# EAGLE design TSOC_PSoC4L (EAGLE 6.6.0)
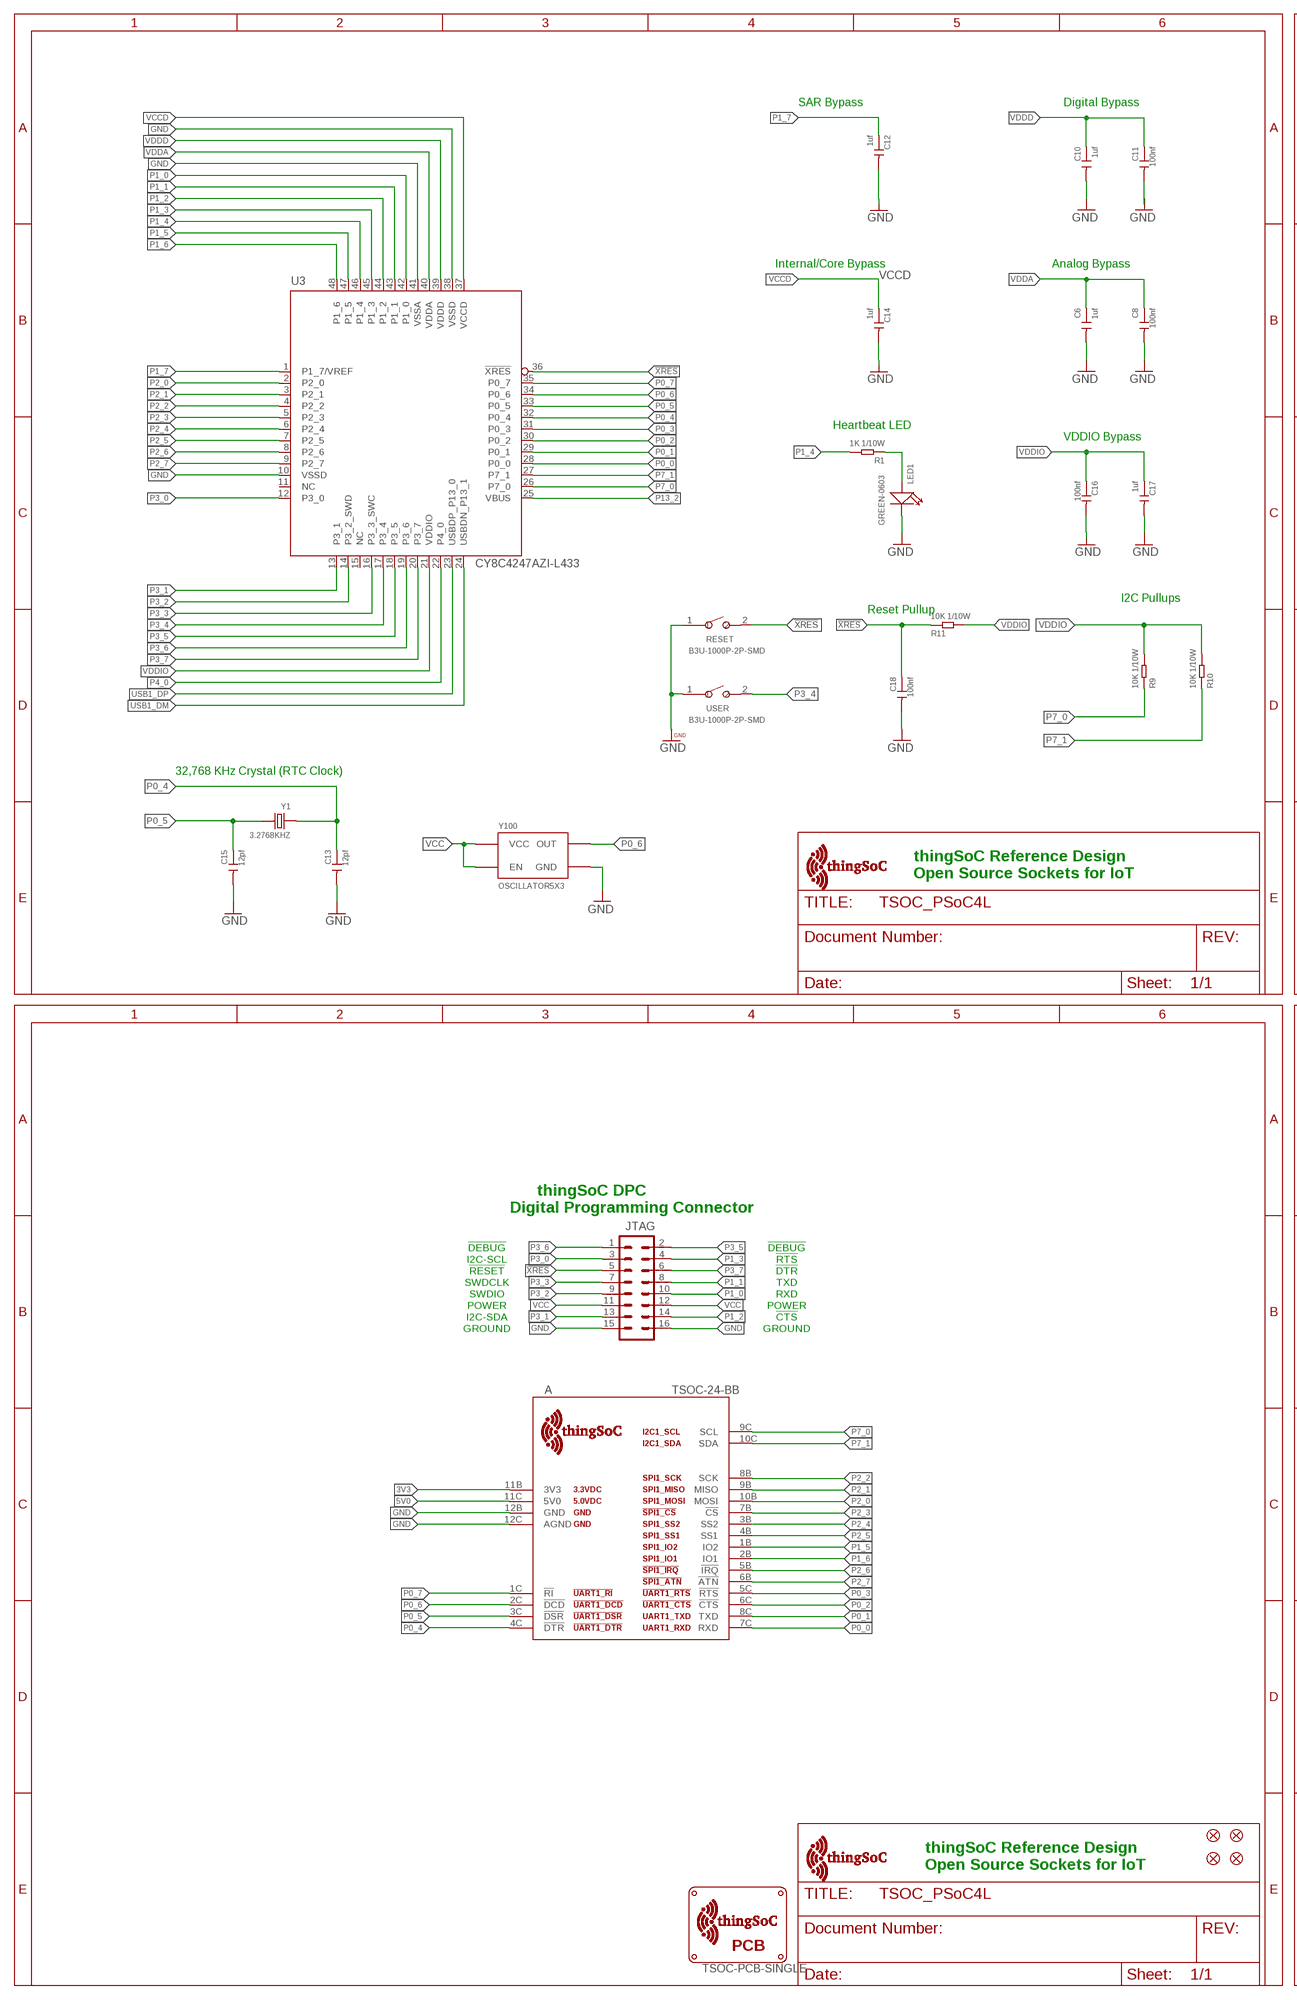
[diagram p0: schematic, sheet 1, part 1 of 2]
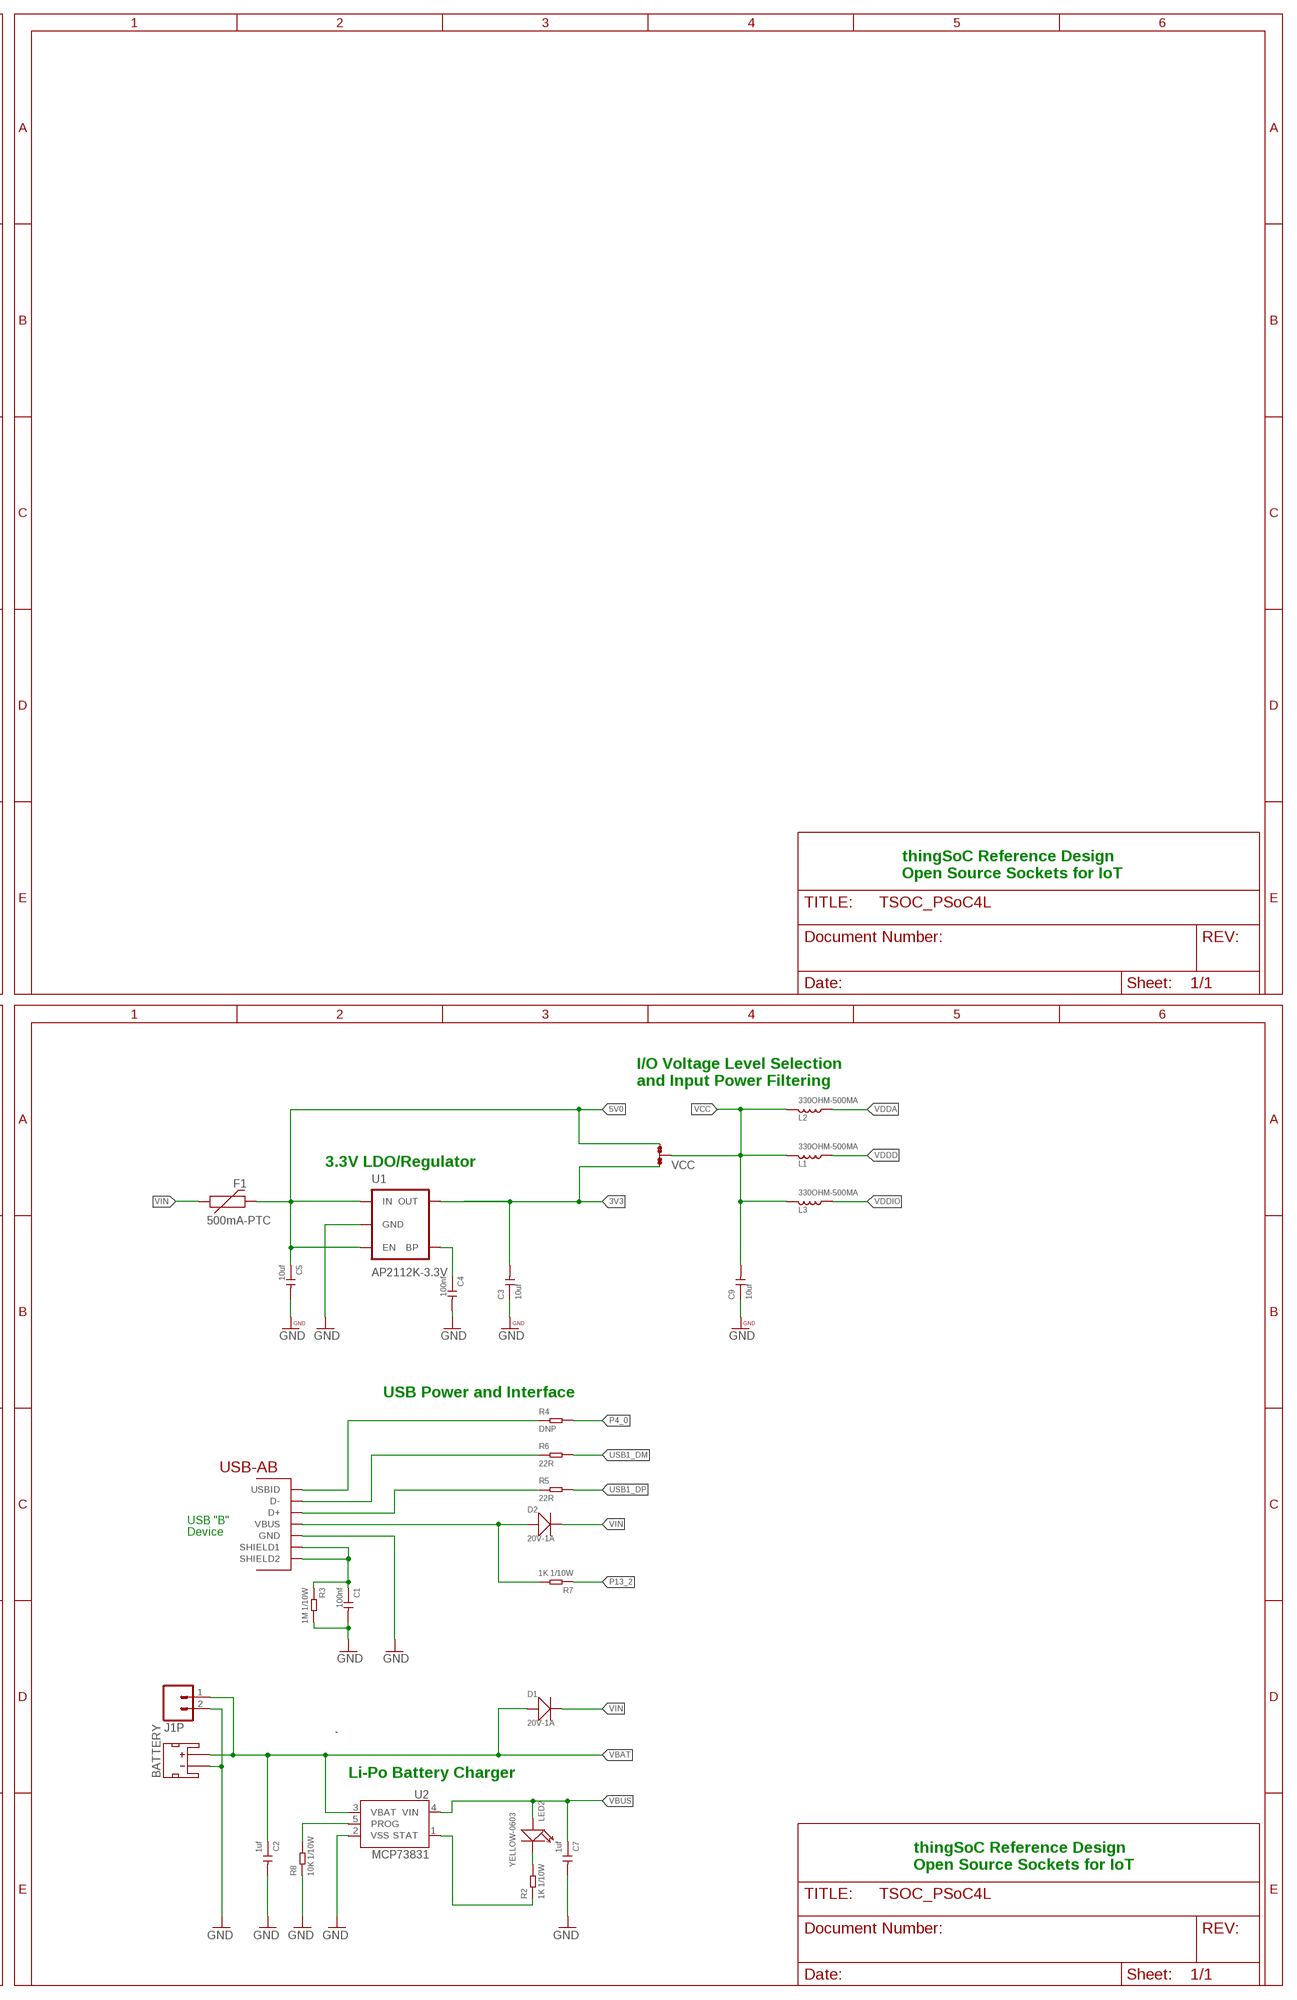
[diagram p1: schematic, sheet 1, part 2 of 2]

## Parts
A  TSOC-24-BB  [TSOC-BB-S24]
BATTERY  JST_2MM_MALE  [JST-2-SMD]
C1  100nf  CERAMIC-100NF-50V-10%-X7R(0603)  [C0603]
C2  1uf  CERAMIC-1UF-25V-10%-X7R(0603)  [C0603]
C3  10uf  CERAMIC-10UF-10V-10%-X5R(0603)  [C0603]
C4  100nf  CERAMIC-100NF-50V-10%-X7R(0603)  [C0603]
C5  10uf  CERAMIC-10UF-10V-10%-X5R(0603)  [C0603]
C6  1uf  CERAMIC-1UF-25V-10%-X7R(0603)  [C0603]
C7  1uf  CERAMIC-1UF-25V-10%-X7R(0603)  [C0603]
C8  100nf  CERAMIC-100NF-50V-10%-X7R(0603)  [C0603]
C9  10uf  CERAMIC-10UF-10V-10%-X5R(0603)  [C0603]
C10  1uf  CERAMIC-1UF-25V-10%-X7R(0603)  [C0603]
C11  100nf  CERAMIC-100NF-50V-10%-X7R(0603)  [C0603]
C12  1uf  CERAMIC-1UF-25V-10%-X7R(0603)  [C0603]
C13  12pf  CERAMIC-12PF-50V-5%-NPO(0603)  [C0603]
C14  1uf  CERAMIC-1UF-25V-10%-X7R(0603)  [C0603]
C15  12pf  CERAMIC-12PF-50V-5%-NPO(0603)  [C0603]
C16  100nf  CERAMIC-100NF-50V-10%-X7R(0603)  [C0603]
C17  1uf  CERAMIC-1UF-25V-10%-X7R(0603)  [C0603]
C18  100nf  CERAMIC-100NF-50V-10%-X7R(0603)  [C0603]
D1  20V-1A  SMD-DIODE-SCHOTTKY-20V-1A(SOD-123)  [SOD-123]
D2  20V-1A  SMD-DIODE-SCHOTTKY-20V-1A(SOD-123)  [SOD-123]
F1  500mA-PTC  PTCSMD  [PTC-1206]
FID1  FIDUCIALUFIDUCIAL  [MICRO-FIDUCIAL]
FID2  FIDUCIALUFIDUCIAL  [MICRO-FIDUCIAL]
FID3  FIDUCIALUFIDUCIAL  [MICRO-FIDUCIAL]
FID4  FIDUCIALUFIDUCIAL  [MICRO-FIDUCIAL]
J1P  M02-JST-2-PTH-NO_SILK  [JST-2-PTH-NS]
JTAG  M08X2  [2X8]
L1  330OHM-500MA  SMD-FERRITE-CHIP-120-OHM-500MA(0603)  [L0603]
L2  330OHM-500MA  SMD-FERRITE-CHIP-120-OHM-500MA(0603)  [L0603]
L3  330OHM-500MA  SMD-FERRITE-CHIP-120-OHM-500MA(0603)  [L0603]
LED1  GREEN-0603  SMD-LED-CLEAR-GREEN(0603)  [LED-0603]
LED2  YELLOW-0603  SMD-LED-CLEAR-YELLOW(0603)  [LED-0603]
R1  1K 1/10W  SMD-RES-1K-5%-1/10W(0603)  [R0603]
R2  1K 1/10W  SMD-RES-1K-5%-1/10W(0603)  [R0603]
R3  1M 1/10W  SMD-RES-1M-5%-1/10W(0603)  [R0603]
R4  DNP  SMD-RES-22R-5%-1/10W(0603)  [R0603]
R5  22R  SMD-RES-22R-5%-1/10W(0603)  [R0603]
R6  22R  SMD-RES-22R-5%-1/10W(0603)  [R0603]
R7  1K 1/10W  SMD-RES-1K-5%-1/10W(0603)  [R0603]
R8  10K 1/10W  SMD-RES-10K-5%-1/10W(0603)  [R0603]
R9  10K 1/10W  SMD-RES-10K-5%-1/10W(0603)  [R0603]
R10  10K 1/10W  SMD-RES-10K-5%-1/10W(0603)  [R0603]
R11  10K 1/10W  SMD-RES-10K-5%-1/10W(0603)  [R0603]
RESET  B3U-1000P-2P-SMD  SMD-BUTTON(2P-3.0X2.5X1.2+0.4MM)-B3U-1000P-2P-SMD  [SW2-2.6-3.0X2.5X1.2+0.4MM]
U1  AP2112K-3.3V  V_REG_LDOSMD  [SOT23-5]
U2  MCP73831  [SOT23-5]
U3  CY8C4247AZI-L433  [TQFP-7X7-48]
U$1  TSOC-PCB-SINGLE  [TSOC-BB-BRD-DIM]
U$100  TSOC-LOGO-LRG  [TSOC-LOGO-LRG]
U$101  TSOC-LOGO-SMALL  [TSOC-LOGO-SML]
USB  USB_AB  [USB-AB-MICRO-SMD]
USER  B3U-1000P-2P-SMD  SMD-BUTTON(2P-3.0X2.5X1.2+0.4MM)-B3U-1000P-2P-SMD  [SW2-2.6-3.0X2.5X1.2+0.4MM]
VCC  JMP-3-1_2  [JMP-3-1_2]
Y1  3.2768KHZ  SMD-CRYSTAL-32.768KHZ-12.5PF-20PPM-90K(2P-L2.0X1.2MM)  [X2-SMD-L2.0X1.2X0.55MM]
Y100  OSCILLATOR5X3  [CRYSTAL-SMD-5X3]

## Nets
3V3: A.11B(3V3) C3.2 U1.5(OUT) VCC.1
5V0: A.11C(5V0) C5.1 F1.2 U1.1(IN) U1.3(EN) VCC.3
!XRES: C18.1 JTAG.5 R11.1 RESET.2 U3.36(!XRES)
BYPASS1: C4.1 U1.4(BP)
CLED: LED2.- R2.2
CSTAT: R2.1 U2.1(STAT)
GND: A.12B(GND) A.12C(AGND) BATTERY.1(-) C1.2 C2.2 C3.1 C4.2 C5.2 C6.2 C7.2 C8.2 C9.1 C10.2 C11.2 C12.2 C13.2 C14.2 C15.2 C16.2 C17.2 C18.2 J1P.2 JTAG.15 JTAG.16 LED1.- R3.2 R8.1 RESET.1 U1.2(GND) U2.2(VSS) U3.10(VSSD) U3.38(VSSD) U3.41(VSSA) USB.GND USER.1 Y100.2(GND)
N$1: R8.2 U2.5(PROG)
N$17: LED1.+ R1.1
P0_0: A.7C(RXD) U3.28(P0_0)
P0_1: A.8C(TXD) U3.29(P0_1)
P0_2: A.6C(!CTS) U3.30(P0_2)
P0_3: A.5C(!RTS) U3.31(P0_3)
P0_4: A.4C(!DTR) C13.1 U3.32(P0_4) Y1.1
P0_5: A.3C(!DSR) C15.1 U3.33(P0_5) Y1.2
P0_6: A.2C(!DCD) U3.34(P0_6) Y100.3(OUT)
P0_7: A.1C(!RI) U3.35(P0_7)
P1_0: JTAG.10 U3.42(P1_0)
P1_1: JTAG.8 U3.43(P1_1)
P1_2: JTAG.14 U3.44(P1_2)
P1_3: JTAG.4 U3.45(P1_3)
P1_4: R1.2 U3.46(P1_4)
P1_5: A.1B(IO2) U3.47(P1_5)
P1_6: A.2B(IO1) U3.48(P1_6)
P1_7: C12.1 U3.1(P1_7/VREF)
P2_0: A.10B(MOSI) U3.2(P2_0)
P2_1: A.9B(MISO) U3.3(P2_1)
P2_2: A.8B(SCK) U3.4(P2_2)
P2_3: A.7B(!CS) U3.5(P2_3)
P2_4: A.3B(SS2) U3.6(P2_4)
P2_5: A.4B(SS1) U3.7(P2_5)
P2_6: A.5B(!IRQ) U3.8(P2_6)
P2_7: A.6B(!ATN) U3.9(P2_7)
P3_0: JTAG.3 U3.12(P3_0)
P3_1: JTAG.13 U3.13(P3_1)
P3_2: JTAG.9 U3.14(P3_2_SWD)
P3_3: JTAG.7 U3.16(P3_3_SWC)
P3_4: U3.17(P3_4) USER.2
P3_5: JTAG.2 U3.18(P3_5)
P3_6: JTAG.1 U3.19(P3_6)
P3_7: JTAG.6 U3.20(P3_7)
P4_0: R4.2 U3.22(P4_0)
P7_0: A.9C(SCL) R9.1 U3.26(P7_0)
P7_1: A.10C(SDA) R10.1 U3.27(P7_1)
P13_2: R7.1 U3.25(VBUS)
USB1_DM: R6.2 U3.24(USBDN_P13_1)
USB1_DP: R5.2 U3.23(USBDP_P13_0)
USB1_I: R4.1 USB.ID(USBID)
USB1_M: R6.1 USB.D-
USB1_P: R5.1 USB.D+
USB1_SHIELD: C1.1 R3.1 USB.SHIELD1 USB.SHIELD2
VBAT: BATTERY.2(+) C2.1 D1.+ J1P.1 U2.3(VBAT)
VBUS: C7.1 D2.+ LED2.+ R7.2 U2.4(VIN) USB.VBUS
VCC: C9.2 JTAG.11 JTAG.12 L1.1 L2.1 L3.1 VCC.2 Y100.1(EN) Y100.4(VCC)
VCCD: C14.1 U3.37(VCCD)
VDDA: C6.1 C8.1 L2.2 U3.40(VDDA)
VDDD: C10.1 C11.1 L1.2 U3.39(VDDD)
VDDIO: C16.1 C17.1 L3.2 R9.2 R10.2 R11.2 U3.21(VDDIO)
VIN: D1.- D2.- F1.1
Unconnected: BATTERY.NC1(PAD1) BATTERY.NC2(PAD2) U3.11(NC) U3.15(NC)

## Notes on the sheet
- SAR Bypass | Digital Bypass
- Internal/Core Bypass | Analog Bypass
- Heartbeat LED
- VDDIO Bypass
- I2C Pullups
- Reset Pullup
- 32,768 KHz Crystal (RTC Clock)
- thingSoC Reference Design
  Open Source Sockets for IoT
- thingSoC Reference Design
  Open Source Sockets for IoT
- I/O Voltage Level Selection
  and Input Power Filtering
- 3.3V LDO/Regulator
- thingSoC DPC
  Digital Programming Connector
- !DEBUG | !DEBUG
- I2C-SCL | !RTS
- !RESET | !DTR
- SWDCLK | TXD
- SWDIO | RXD
- POWER | POWER
- I2C-SDA | !CTS
- GROUND | GROUND
- USB Power and Interface
- USB "B"
- Device
- Li-Po Battery Charger
- thingSoC Reference Design
  Open Source Sockets for IoT
- thingSoC Reference Design
  Open Source Sockets for IoT

## Library data of the parts
A = thingSoC:TSOC-24: thingSoC Twenty-Four(24) Pin Socket Source LBR : http://www.thingsoc.com Github : https://github.com/thingsoc License : http://creativecommons.org/licenses/by-sa/4.0/ (Creative Commons 4.0) THIS SOFTWARE IS PROVIDED BY THE CONTRIBUTORS "AS IS" AND WITHOUT ANY EXPRESS OR IMPLIED WARRANTIES, INCLUDING, BUT NOT LIMITED TO, THE IMPLIED WARRANTIES OF MERCHANTABILITY AND FITNESS FOR A PARTICULAR PURPOSE ARE DISCLAIMED. IN NO EVENT SHALL THE COPYRIGHT OWNER OR CONTRIBUTORS BE LIABLE FOR ANY DIRECT, INDIRECT, INCIDENTAL, SPECIAL, EXEMPLARY, OR CONSEQUENTIAL DAMAGES (INCLUDING, BUT NOT LIMITED TO, PROCUREMENT OF SUBSTITUTE GOODS OR SERVICES; LOSS OF USE, DATA, OR PROFITS; OR BUSINESS INTERRUPTION) HOWEVER CAUSED AND ON ANY THEORY OF LIABILITY, WHETHER IN CONTRACT, STRICT LIABILITY, OR TORT (INCLUDING NEGLIGENCE OR OTHERWISE) ARISING IN ANY WAY OUT OF THE USE OF THIS SOFTWARE, EVEN IF ADVISED OF THE POSSIBILITY OF SUCH DAMAGE.
BATTERY = TSOC-ESP8266-BASE:JST_2MM_MALE: Mates to single-cell LiPo batteries. CONN-11443 Now with smashable polarity marks!; BTM_NEG: -; BTM_POS: +; PROD_ID: CONN-11443; TOP_NEG: -; TOP_POS: +
C1 C4 C8 C11 C16 C18 = Seeed-Capacitor-2016:CERAMIC-100NF-50V-10%-X7R(0603): 302010138; MPN: CC0603KRX7R9BB104
C2 C6 C7 C10 C12 C14 C17 = Seeed-Capacitor-2016:CERAMIC-1UF-25V-10%-X7R(0603): 302010139; MPN: CC0603KRX7R8BB105
C3 C5 C9 = Seeed-Capacitor-2016:CERAMIC-10UF-10V-10%-X5R(0603): 302010103; MPN: CC0603KRX5R6BB106
C13 C15 = Seeed-Capacitor-2016:CERAMIC-12PF-50V-5%-NPO(0603): 302010067; MPN: CC0603JRNPO9BN120
D1 D2 = Seeed-Diode-2016:SMD-DIODE-SCHOTTKY-20V-1A(SOD-123): 304020034; MPN: B5819W
F1 = SparkFun:PTC: Resettable Fuse PTC Resettable Fuse. Spark Fun Electronics SKU : COM-08357
FID1-FID4 = TSOC-ESP8266-BASE:FIDUCIAL: Fiducial Alignment Points Various fiducial points for machine vision alignment.
J1P = TSOC-ESP8266-BASE:M02: Standard 2-pin 0.1" header. Use with - straight break away headers ( PRT-00116) - right angle break away headers (PRT-00553) - swiss pins (PRT-00743) - machine pins (PRT-00117) - female headers (PRT-00115) Molex polarized connector foot print use with: PRT-08233 with associated crimp pins and housings. 2.54_SCREWTERM for use with PRT-10571. 3.5mm Screw Terminal footprints for PRT-08084 5mm Screw Terminal footprints for use with PRT-08432
JTAG = PatternAgents-ProtoPads:M08X2: .1" headers, two rows of 8 each
L1-L3 = Seeed-Inductor-2016:SMD-FERRITE-CHIP-120-OHM-500MA(0603): 303030001; MPN: BLM18AG121SN1D; VALUE: 120OHM-500MA
LED1 = Seeed-LED-2016:SMD-LED-CLEAR-GREEN(0603): 304090043; MPN: 19-217-G7C-AN1P2-3T
LED2 = Seeed-LED-2016:SMD-LED-CLEAR-YELLOW(0603): 304090044; MPN: 19-217-Y5C-AM1N1VY-3T
R1 R2 R7 = Seeed-Resistor-2016:SMD-RES-1K-5%-1/10W(0603): 301010291; MPN: RC0603JR-071KL
R3 = Seeed-Resistor-2016:SMD-RES-1M-5%-1/10W(0603): 301010100; MPN: RC0603JR-071ML
R4 = Seeed-Resistor-2016:SMD-RES-22R-5%-1/10W(0603): 301010289; MPN: RC0603JR-0722RL; VALUE: 22R
R5 R6 = Seeed-Resistor-2016:SMD-RES-22R-5%-1/10W(0603): 301010289; MPN: RC0603JR-0722RL
R8-R11 = Seeed-Resistor-2016:SMD-RES-10K-5%-1/10W(0603): 301010293; MPN: RC0603JR-0710KL
RESET USER = Seeed-Switch-2016:SMD-BUTTON(2P-3.0X2.5X1.2+0.4MM): 311020047; MPN: B3U-1000P-2P-SMD
U1 = SparkFun-PowerIC:V_REG_LDO: Voltage Regulator LDO Standard 150mA LDO voltage regulator in SOT-23 layout. Micrel part MIC5205. BP (by-pass) pin is used to lower output noise with 470pF cap.; PROD_ID: VREG-12457
U2 = TSOC-ESP8266-BASE:MCP73831: Miniature single cell, fully integrated Li-Ion, Li-polymer charge management controller http://ww1.microchip.com/downloads/en/DeviceDoc/20001984g.pdf IC-09995; PROD_ID: IC-09995
U3 = PatternAgents-Cypress:CY8C4247AZI-L433: Cypress PSoC® 4 - Programmable System on Chip, Cortex-M0 Based : USB Version! http://www.cypress.com/?mpn=CY8C4247AZI-L433 LBR Source: http://www.patternagents.com THIS SOFTWARE IS PROVIDED BY THE CONTRIBUTORS "AS IS" AND WITHOUT ANY EXPRESS OR IMPLIED WARRANTIES, INCLUDING, BUT NOT LIMITED TO, THE IMPLIED WARRANTIES OF MERCHANTABILITY AND FITNESS FOR A PARTICULAR PURPOSE ARE DISCLAIMED. IN NO EVENT SHALL THE COPYRIGHT OWNER OR CONTRIBUTORS BE LIABLE FOR ANY DIRECT, INDIRECT, INCIDENTAL, SPECIAL, EXEMPLARY, OR CONSEQUENTIAL DAMAGES (INCLUDING, BUT NOT LIMITED TO, PROCUREMENT OF SUBSTITUTE GOODS OR SERVICES; LOSS OF USE, DATA, OR PROFITS; OR BUSINESS INTERRUPTION) HOWEVER CAUSED AND ON ANY THEORY OF LIABILITY, WHETHER IN CONTRACT, STRICT LIABILITY, OR TORT (INCLUDING NEGLIGENCE OR OTHERWISE) ARISING IN ANY WAY OUT OF THE USE OF THIS SOFTWARE, EVEN IF ADVISED OF THE POSSIBILITY OF SUCH DAMAGE.
U$1 = thingSoC:TSOC-PCB: thingSoC PCB Outlines Boards Outlines for Standard Sizes (in the DImension Layer) (Registration marks in the tDocu layer - make sure to turn on tDocu/bDocu) Source LBR : http://www.thingsoc.com Github : https://github.com/thingsoc License : http://creativecommons.org/licenses/by-sa/4.0/ (Creative Commons 4.0) THIS SOFTWARE IS PROVIDED BY THE CONTRIBUTORS "AS IS" AND WITHOUT ANY EXPRESS OR IMPLIED WARRANTIES, INCLUDING, BUT NOT LIMITED TO, THE IMPLIED WARRANTIES OF MERCHANTABILITY AND FITNESS FOR A PARTICULAR PURPOSE ARE DISCLAIMED. IN NO EVENT SHALL THE COPYRIGHT OWNER OR CONTRIBUTORS BE LIABLE FOR ANY DIRECT, INDIRECT, INCIDENTAL, SPECIAL, EXEMPLARY, OR CONSEQUENTIAL DAMAGES (INCLUDING, BUT NOT LIMITED TO, PROCUREMENT OF SUBSTITUTE GOODS OR SERVICES; LOSS OF USE, DATA, OR PROFITS; OR BUSINESS INTERRUPTION) HOWEVER CAUSED AND ON ANY THEORY OF LIABILITY, WHETHER IN CONTRACT, STRICT LIABILITY, OR TORT (INCLUDING NEGLIGENCE OR OTHERWISE) ARISING IN ANY WAY OUT OF THE USE OF THIS SOFTWARE, EVEN IF ADVISED OF THE POSSIBILITY OF SUCH DAMAGE.
U$100 U$101 = thingSoC:TSOC-LOGO: thingSoC Logo Source LBR : http://www.thingsoc.com Github : https://github.com/thingsoc License : http://creativecommons.org/licenses/by-sa/4.0/ (Creative Commons 4.0) THIS SOFTWARE IS PROVIDED BY THE CONTRIBUTORS "AS IS" AND WITHOUT ANY EXPRESS OR IMPLIED WARRANTIES, INCLUDING, BUT NOT LIMITED TO, THE IMPLIED WARRANTIES OF MERCHANTABILITY AND FITNESS FOR A PARTICULAR PURPOSE ARE DISCLAIMED. IN NO EVENT SHALL THE COPYRIGHT OWNER OR CONTRIBUTORS BE LIABLE FOR ANY DIRECT, INDIRECT, INCIDENTAL, SPECIAL, EXEMPLARY, OR CONSEQUENTIAL DAMAGES (INCLUDING, BUT NOT LIMITED TO, PROCUREMENT OF SUBSTITUTE GOODS OR SERVICES; LOSS OF USE, DATA, OR PROFITS; OR BUSINESS INTERRUPTION) HOWEVER CAUSED AND ON ANY THEORY OF LIABILITY, WHETHER IN CONTRACT, STRICT LIABILITY, OR TORT (INCLUDING NEGLIGENCE OR OTHERWISE) ARISING IN ANY WAY OUT OF THE USE OF THIS SOFTWARE, EVEN IF ADVISED OF THE POSSIBILITY OF SUCH DAMAGE.
USB = BeeSafe:USB_AB: This is a USB AB connector that is compatible with USB OTG. i.e. this connector can serve as a host or device
VCC = PatternAgents-ProtoPads:JMP-3-1_2: Three Terminal Jumper - 1 & 2 Connected Positions 1and 2 are normally connected. PatternAgents ProtoPads Library Schematic and PCB layout libraries for design patterns by PatternAgents. For the CADSoft Eagle CAD program : http://www.cadsoftusa.com/download-eagle/ Source LBR : http://www.patternagents.com Github : https://github.com/PatternAgents License : http://creativecommons.org/licenses/by-sa/4.0/ (Creative Commons 4.0) THIS SOFTWARE IS PROVIDED BY THE CONTRIBUTORS "AS IS" AND WITHOUT ANY EXPRESS OR IMPLIED WARRANTIES, INCLUDING, BUT NOT LIMITED TO, THE IMPLIED WARRANTIES OF MERCHANTABILITY AND FITNESS FOR A PARTICULAR PURPOSE ARE DISCLAIMED. IN NO EVENT SHALL THE COPYRIGHT OWNER OR CONTRIBUTORS BE LIABLE FOR ANY DIRECT, INDIRECT, INCIDENTAL, SPECIAL, EXEMPLARY, OR CONSEQUENTIAL DAMAGES (INCLUDING, BUT NOT LIMITED TO, PROCUREMENT OF SUBSTITUTE GOODS OR SERVICES; LOSS OF USE, DATA, OR PROFITS; OR BUSINESS INTERRUPTION) HOWEVER CAUSED AND ON ANY THEORY OF LIABILITY, WHETHER IN CONTRACT, STRICT LIABILITY, OR TORT (INCLUDING NEGLIGENCE OR OTHERWISE) ARISING IN ANY WAY OUT OF THE USE OF THIS SOFTWARE, EVEN IF ADVISED OF THE POSSIBILITY OF SUCH DAMAGE.; BOM: EXCLUDE
Y1 = Seeed-Crystal Oscillator-2016:SMD-CRYSTAL-32.768KHZ-12.5PF-20PPM-90K(2P-L2.0X1.2MM): 306010020; MPN: FC-12M
Y100 = SparkFun-FreqCtrl:OSCILLATOR: Generic 5x3 and 7x5 oscillators

## Net classes
1 vcc: width 0.254 mm

## Board
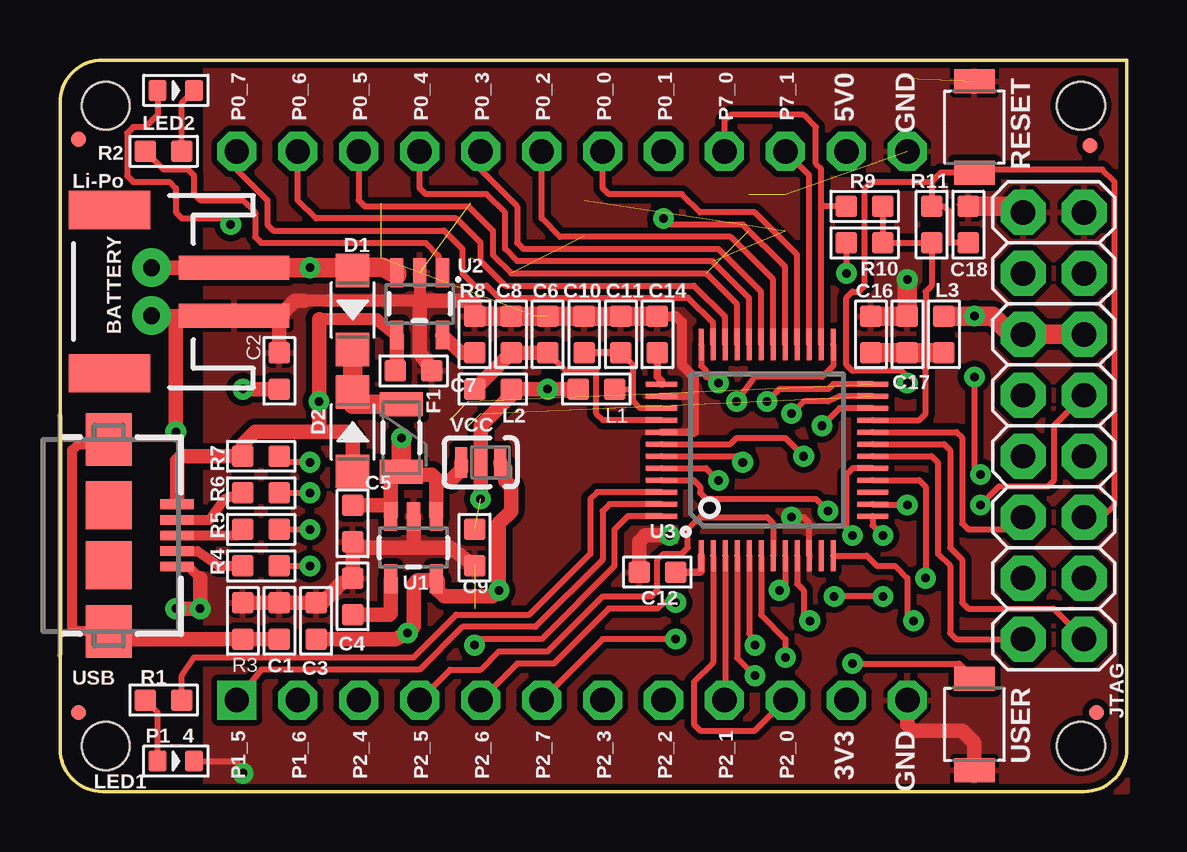
[diagram p2: board, top side]
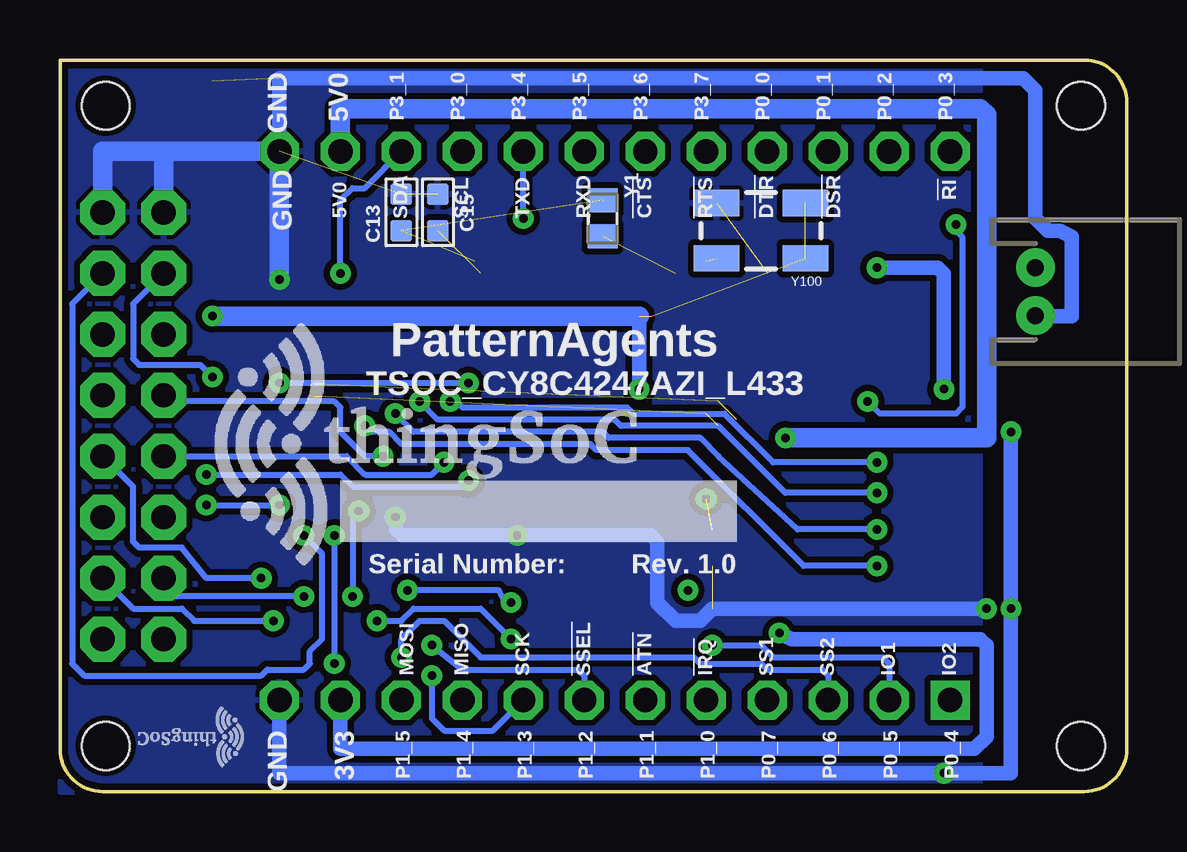
[diagram p3: board, bottom side, seen from below]

Size 44.45 x 30.48 mm. Coordinates in mm from the lower left corner, seen from the top.
Copper layers (1*16): Top 0.035mm / dielectric 1.5mm / Bottom 0.035mm
Design rules "PatternAgents_7mil": minimum track width 7mil, minimum drill 14mil, track to track 7mil, track to pad 7mil, pad to pad 7mil, via to via 7mil, smd to smd 7mil, copper to edge 7mil, drill to drill 7mil, minimum pad ring 12mil, minimum via ring 10mil, stop-mask expansion 4mil, vias tented up to drill 25mil, thermal gap 7mil

### Footprints (pad centres in the part's own frame; a part is rotated, then mirrored left to right if it is on the bottom)
TSOC-BB-S24 = drill 1.016 square: 1B -11.43,11.43 | drill 1.016 octagon: 1C 11.43,11.43; 2B -11.43,8.89; 2C 11.43,8.89; 3B -11.43,6.35; 3C 11.43,6.35; 4B -11.43,3.81; 4C 11.43,3.81; 5B -11.43,1.27; 5C 11.43,1.27; 6B -11.43,-1.27; 6C 11.43,-1.27; 7B -11.43,-3.81; 7C 11.43,-3.81; 8B -11.43,-6.35; 8C 11.43,-6.35; 9B -11.43,-8.89; 9C 11.43,-8.89; 10B -11.43,-11.43; 10C 11.43,-11.43; 11B -11.43,-13.97; 11C 11.43,-13.97; 12B -11.43,-16.51; 12C 11.43,-16.51
JST-2-SMD = smd 1 x 4.6: 1 -1,-3.7; 2 1,-3.7 | smd 1.6 x 3.4: NC1 -3.4,1.5; NC2 3.4,1.5
C0603 = smd 0.889 x 0.889: 1 0,0.762; 2 0,-0.762
SOD-123 = smd 1.397 x 1.397: + -1.651,0; - 1.651,0
PTC-1206 = smd 1 x 1.8: 1 -1.4,0; 2 1.4,0
MICRO-FIDUCIAL = smd 0.635 x 0.635: 1 0,0
JST-2-PTH-NS = drill 0.7 pad 1.6: 1 -1,0; 2 1,0
2X8 = drill 1.016 pad 1.88 octagon: 1 0,0; 2 0,2.54; 3 2.54,0; 4 2.54,2.54; 5 5.08,0; 6 5.08,2.54; 7 7.62,0; 8 7.62,2.54; 9 10.16,0; 10 10.16,2.54; 11 12.7,0; 12 12.7,2.54; 13 15.24,0; 14 15.24,2.54; 15 17.78,0; 16 17.78,2.54
L0603 = smd 0.889 x 0.889: 1 -0.762,0; 2 0.762,0
LED-0603 = smd 0.762 x 0.889: + -0.762,0; - 0.762,0
R0603 = smd 0.889 x 0.889: 1 0,0.762; 2 0,-0.762
SW2-2.6-3.0X2.5X1.2+0.4MM = smd 1 x 1.7: 1 -1.9,0; 2 1.9,0
SOT23-5 = smd 0.55 x 1.2: 1 -0.95,-1.3; 2 0,-1.3; 3 0.95,-1.3; 4 0.95,1.3; 5 -0.95,1.3
TQFP-7X7-48 = smd 1.3 x 0.21: 1 -4.4,2.75; 2 -4.4,2.25; 3 -4.4,1.75; 4 -4.4,1.25; 5 -4.4,0.75; 6 -4.4,0.25; 7 -4.4,-0.25; 8 -4.4,-0.75; 9 -4.4,-1.25; 10 -4.4,-1.75; 11 -4.4,-2.25; 12 -4.4,-2.75; 25 4.4,-2.75; 26 4.4,-2.25; 27 4.4,-1.75; 28 4.4,-1.25; 29 4.4,-0.75; 30 4.4,-0.25; 31 4.4,0.25; 32 4.4,0.75; 33 4.4,1.25; 34 4.4,1.75; 35 4.4,2.25; 36 4.4,2.75 | smd 0.21 x 1.3: 13 -2.75,-4.4; 14 -2.25,-4.4; 15 -1.75,-4.4; 16 -1.25,-4.4; 17 -0.75,-4.4; 18 -0.25,-4.4; 19 0.25,-4.4; 20 0.75,-4.4; 21 1.25,-4.4; 22 1.75,-4.4; 23 2.25,-4.4; 24 2.75,-4.4; 37 2.75,4.4; 38 2.25,4.4; 39 1.75,4.4; 40 1.25,4.4; 41 0.75,4.4; 42 0.25,4.4; 43 -0.25,4.4; 44 -0.75,4.4; 45 -1.25,4.4; 46 -1.75,4.4; 47 -2.25,4.4; 48 -2.75,4.4
TSOC-BB-BRD-DIM = hole 2: 13.335,16.891; -13.335,16.891; 13.335,-23.749; -13.335,-23.749
USB-AB-MICRO-SMD = smd 1.4 x 0.4: D+ 2.85,0; D- 2.85,0.65; GND 2.85,-1.3; ID 2.85,-0.65; VBUS 2.85,1.3 | smd 1.9 x 2: P$6 0,1.25; P$7 0,-1.25 | smd 1.9 x 2.2: SHIELD1 0,4; SHIELD2 0,-4
JMP-3-1_2 = smd 0.508 x 1.27: 1 -0.813,0; 2 0,0; 3 0.813,0
X2-SMD-L2.0X1.2X0.55MM = smd 1 x 1.25: 1 -0.75,0; 2 0.75,0
CRYSTAL-SMD-5X3 = smd 1.9 x 1.1: 1 -1.85,-1.15; 2 1.85,-1.15; 3 1.85,1.15; 4 -1.85,1.15

### Placement (x,y rotation side)
A  18.8,15.24 90 top
BATTERY  3.56,20.83 90 top
C1  9.14,7.11 180 top
C2  9.14,17.53 180 top
C3  10.67,7.11 0 top
C4  12.19,8.13 180 top
C5  12.19,11.18 0 top
C6  20.32,19.05 180 top
C7  14.73,17.53 90 top
C8  18.8,19.05 180 top
C9  17.27,10.16 180 top
C10  21.84,19.05 180 top
C11  23.37,19.05 180 top
C12  24.89,9.14 270 top
C13  30.23,24.13 180 bottom
C14  24.89,19.05 180 top
C15  28.7,24.13 180 bottom
C16  33.78,19.05 180 top
C17  35.31,19.05 180 top
C18  37.85,23.62 180 top
D1  12.19,20.07 270 top
D2  12.19,14.99 90 top
F1  14.22,14.73 270 top
FID1  0.76,3.3 180 top
FID2  0.76,27.18 180 top
FID3  42.93,26.92 180 top
FID4  43.18,3.3 180 top
J1P  3.81,20.83 270 bottom
JTAG  42.67,6.35 90 top
L1  22.35,16.76 0 top
L2  18.03,16.76 180 top
L3  36.83,19.05 270 top
LED1  4.83,1.27 0 top
LED2  4.83,29.21 0 top
R1  4.32,3.81 90 top
R2  4.32,26.67 90 top
R3  7.62,7.11 180 top
R4  8.38,9.4 90 top
R5  8.38,10.92 90 top
R6  8.38,12.45 90 top
R7  8.38,13.97 270 top
R8  17.27,19.05 0 top
R9  33.53,24.38 90 top
R10  33.53,22.86 90 top
R11  36.32,23.62 0 top
RESET  38.1,27.69 270 top
U1  14.73,10.16 180 top
U2  14.99,20.32 180 top
U3  29.46,14.22 90 top
U$1  18.8,15.24 90 top
U$100  34.8,14.48 0 bottom
U$101  37.59,2.29 180 bottom
USB  2.03,10.67 0 top
USER  38.1,2.79 90 top
VCC  17.53,13.72 180 top
Y1  21.84,23.88 270 bottom
Y100  15.24,23.37 180 bottom

### Tracks (layer width: path | path; a pad name or v marks a point on that pad's centre or on a via)
3V3  (via drill 0.36)
  Top 0.61: 15.75,8.79 14.89,8.79 14.73,8.64 14.73,6.86 v14.48,6.6 13.97,6.35 C3.2 | 15.75,8.79 15.75,8.38 16,8.13 18.03,8.13 v18.29,8.38 18.29,11.18 18.8,11.68 18.8,12.7 18.54,12.95 18.54,13.46 18.34,13.66 VCC.1 | 15.75,8.79 U1.5
  Bottom 0.61: A.11B 32.77,1.78 6.35,1.78 5.84,2.29 5.84,6.1 6.1,6.35 13.97,6.35 v14.48,6.6
5V0  (via drill 0.36)
  Top 0.61: C5.1 13.75,11.94 U1.3 13.78,13.14 F1.2 13.84,13.21 15.49,13.21 15.68,13.02 | U1.1 15.68,13.02 | VCC.3 16.71,13.41 16.26,12.95 15.75,12.95 15.68,13.02
  Top 0.813: F1.2 v14.22,14.73
  Bottom 0.813: v14.22,14.73 5.84,14.73 5.84,28.19 6.1,28.45 32.77,28.45 A.11C
!XRES  (via drill 0.36)
  Top 0.254: U3.36 26.71,17.74 26.92,17.53 26.92,17.27 v27.43,17.02 | C18.1 37.08,22.86 37.08,24.13 36.83,24.38 R11.1 36.32,25.4 | 36.32,25.4 36.71,25.79 RESET.2 38.22,25.91 43.43,25.91 43.94,25.4 43.94,11.94 43.43,11.43 JTAG.5 | v35.31,17.02 35.31,17.27 35.05,17.53 33.02,17.53 32.77,17.78 32.77,20.57 33.02,20.83 33.27,20.83 33.53,21.08 33.53,25.15 33.78,25.4 36.32,25.4
  Bottom 0.254: v27.43,17.02 v35.31,17.02
BYPASS1
  Top 0.61: U1.4 13.78,7.43 13.72,7.37 C4.1
CLED
  Top 0.254: R2.2 5.08,28.7 LED2.-
CSTAT
  Top 0.254: U2.1 16,21.69 15.75,22.35 15.24,22.86 8.38,22.86 8.13,23.11 8.13,24.13 7.62,24.64 5.84,24.64 5.59,24.89 5.59,25.65 5.33,25.91 4.32,25.91 R2.1
GND  (via drill 0.36)  (5 unrouted)
  Top 0.254: LED1.- 7.37,1.27 v7.62,0.76 | U3.10 31.21,11.2 30.99,11.43 v30.48,11.43
  Top 0.305: U3.38 26.38,16.47 26.42,16.51 | U3.41 26.4,14.97 26.42,14.99
  Top 0.406: USB.GND 5.36,9.37 5.84,8.89 | C14.2 25.65,19.81 25.91,19.56 25.91,17.78 26.42,17.27 26.42,16.51 26.42,14.99
  Top 0.508: U2.2 14.99,20.45 10.16,20.45
  Top 0.61: 5.84,8.89 v5.84,7.62 v4.83,7.62 | R3.2 C1.2 C3.1 10.92,7.87 11.68,8.64 C4.2 C5.2 12.45,10.16 14.73,10.16 | 9.14,19.81 7.27,19.81 BATTERY.1 7.24,19.81 4.83,19.81 | C2.2 9.14,19.81 | R8.1 17.27,20.32 16.89,20.45 14.99,20.45 14.99,18.29 C7.2 | 4.83,19.81 v4.83,14.99 | 4.83,19.81 3.83,19.81 J1P.2 | 14.73,10.16 U1.2 | USER.1 38.1,2.03 37.59,2.54 35.56,2.54 35.31,2.79 A.12B | 10.16,20.45 9.78,20.45 9.14,19.81 | C9.1 16.26,10.16 14.73,10.16 | C12.2 24.13,10.41 24.38,10.67 v25.4,10.67
  Top 0.813: R8.1 C8.2 C6.2 C10.2 C11.2 C14.2 | C16.2 C17.2 v35.31,21.34 | C18.2 39.88,24.38 JTAG.16
  Bottom 0.61: 3.83,19.81 J1P.2 3.79,19.81 2.29,19.81 2.29,23.11 2.79,23.37 3.3,23.37 3.81,23.88 3.81,29.21 4.32,29.72 35.31,29.72 A.12C | v4.83,14.99 v4.83,7.62 4.83,0.76 v7.62,0.76 35.31,0.76 A.12B | v5.84,7.62 17.27,7.62 17.78,7.11 18.8,7.11 19.56,7.87 19.56,10.41 19.81,10.67 v25.4,10.67 30.2,10.67 30.45,10.92 30.45,11.4 v30.48,11.43
  Bottom 0.813: 39.88,26.67 A.12C v35.31,21.34 | 39.88,26.67 42.67,26.67 JTAG.15 | JTAG.16 40.13,26.42 39.88,26.67
  pour Top (isolate 0.254, hatched): 44.45,30.48 44.45,0 6.1,0 6.1,30.48
  pour Bottom (isolate 0.254, hatched): 44.45,30.48 44.45,0 6.1,0 6.1,30.48
N$1
  Top 0.61: R8.2 16.73,18.29 U2.5
N$17
  Top 0.254: LED1.+ 4.06,3.3 R1.1
P0_0
  Top 0.254: U3.28 30.71,22.37 28.96,24.13 26.67,24.13 25.91,24.89 22.86,24.89 22.61,25.15 A.7C
P0_1  (via drill 0.36)
  Top 0.254: U3.29 30.21,21.86 28.45,23.62 25.4,23.62 v25.15,23.88
  Bottom 0.254: v25.15,23.88 A.8C
P0_2
  Top 0.254: U3.30 29.71,21.34 27.94,23.11 20.83,23.11 20.07,23.88 A.6C
P0_3
  Top 0.254: A.5C 17.53,25.91 19.05,24.38 19.05,22.86 19.3,22.61 27.43,22.61 29.21,20.82 U3.31
P0_4  (2 unrouted)
  Top 0.254: U3.32 28.71,20.56 27.18,22.1 19.05,22.1 18.54,22.61 18.54,24.13 17.78,24.89 15.24,24.89 14.99,25.15 A.4C
P0_5  (2 unrouted)
  Top 0.254: A.3C 12.45,24.64 12.7,24.38 17.02,24.38 18.03,23.37 18.03,22.35 18.8,21.59 26.92,21.59 28.21,20.3 U3.33
P0_6  (1 unrouted)
  Top 0.254: A.2C 9.91,24.64 10.67,23.88 16.51,23.88 17.53,22.86 17.53,22.1 18.54,21.08 26.42,21.08 27.71,19.78 U3.34
P0_7
  Top 0.254: A.1C 7.37,25.91 8.64,24.64 8.64,23.62 8.89,23.37 16,23.37 16.76,22.61 16.76,21.59 17.27,21.08 17.78,21.08 18.29,20.57 26.16,20.57 27.21,19.52 U3.35
P1_0  (via drill 0.36)
  Top 0.254: U3.42 27.94,14.47 28.19,14.73 30.23,14.73 v30.99,13.97
  Bottom 0.254: v30.99,13.97 31.75,13.97 32.77,14.99 32.77,16 33.02,16.26 39.88,16.26 JTAG.10
P1_1  (via drill 0.36)
  Top 0.254: U3.43 28.19,13.97 v28.45,13.72
  Bottom 0.254: JTAG.8 32.51,13.97 31.75,13.21 28.96,13.21 v28.45,13.72
P1_2  (via drill 0.36)
  Top 0.254: U3.44 26.91,13.47 v27.43,12.95 | v38.1,17.27 38.1,13.46 v38.35,13.21
  Bottom 0.254: JTAG.14 41.4,20.32 41.4,18.03 41.15,17.78 38.61,17.78 v38.1,17.27 | v38.35,13.21 32.77,13.21 32.26,12.7 27.69,12.7 v27.43,12.95
P1_3  (via drill 0.36)
  Top 0.254: v34.29,8.13 v32.26,8.13 | U3.45 26.4,12.97 26.67,12.7 26.67,12.45 26.92,12.19 31.5,12.19 v32,11.68
  Bottom 0.254: v32.26,8.13 32.26,11.43 v32,11.68 | v34.29,8.13 39.62,8.13 JTAG.4
P1_4
  Top 0.254: R1.2 5.08,4.83 5.59,5.59 14.73,5.59 16.51,7.37 19.56,7.37 22.1,9.91 22.1,12.19 22.38,12.47 U3.46
P1_5
  Top 0.254: A.1B 8.38,5.08 14.99,5.08 16.76,6.86 19.81,6.86 22.61,9.65 22.61,11.68 22.9,11.97 U3.47
P1_6  (via drill 0.36)
  Top 0.254: v17.27,6.1 17.27,6.35 20.07,6.35 23.11,9.4 23.11,10.92 23.67,11.47 U3.48
  Bottom 0.254: v17.27,6.1 15.24,6.1 14.73,5.59 10.16,5.59 9.91,5.33 A.2B
P1_7
  Top 0.305: U3.1 26.71,9.19 26.67,9.14 C12.1
P2_0
  Top 0.254: U3.2 27.21,5.37 26.42,4.57 26.42,2.79 26.67,2.54 28.96,2.54 A.10B
P2_1
  Top 0.254: U3.3 27.71,3.84 A.9B
P2_2  (via drill 0.36)
  Top 0.254: U3.4 28.21,5.57 v28.96,4.83
  Bottom 0.254: v28.96,4.83 28.96,3.05 28.45,2.54 26.42,2.54 A.8B
P2_3  (via drill 0.36)
  Top 0.254: U3.5 28.71,6.59 v28.96,6.1
  Bottom 0.254: v28.96,6.1 27.69,5.08 22.86,5.08 22.61,4.83 A.7B
P2_4  (via drill 0.36)
  Top 0.254: U3.6 29.21,7.36 30.23,6.35 v30.23,5.59
  Bottom 0.254: v30.23,5.59 30.23,6.35 29.46,7.11 28.45,7.11 26.92,5.59 18.03,5.59 17.78,5.33 15.24,5.33 14.99,5.08 12.7,5.08 12.45,4.83 A.3B
P2_5
  Top 0.254: A.4B 16.26,5.08 17.53,5.08 18.29,5.84 20.32,5.84 22.61,8.13 24.64,8.13 24.89,8.38 24.89,9.65 25.15,9.91 25.91,9.91 26.16,10.16 26.16,10.92 26.67,11.43 29.46,11.43 29.72,11.18 U3.7
P2_6  (via drill 0.36)
  Top 0.254: U3.8 30.21,8.62 v29.97,8.38 | v25.65,7.87 25.15,7.87 24.89,7.62 22.86,7.62 20.57,5.33 19.05,5.33 A.5B
  Bottom 0.254: v25.65,7.87 25.91,7.87 26.16,8.38 v29.97,8.38
P2_7  (via drill 0.36)
  Top 0.254: U3.9 30.71,8.66 30.99,8.38 30.99,7.37 v31.24,7.11 | v25.65,6.35 22.61,6.35 A.6B
  Bottom 0.254: v31.24,7.11 30.23,7.11 29.72,7.62 26.92,7.62 v25.65,6.35
P3_0  (via drill 0.36)
  Top 0.254: U3.12 33.61,9.82 34.04,9.4 34.8,9.4 35.31,8.89 35.31,7.37 v35.56,7.11
  Bottom 0.254: JTAG.3 41.4,7.62 39.37,7.62 38.86,7.11 v35.56,7.11
P3_1  (via drill 0.36)
  Top 0.254: U3.13 33.86,11.09 v34.29,10.67
  Bottom 0.254: JTAG.13 43.94,20.32 43.94,5.33 43.43,4.83 36.07,4.83 35.81,5.08 34.29,5.08 34.04,5.33 34.04,5.84 33.53,6.35 33.53,9.91 v34.29,10.67
P3_2  (via drill 0.36)
  Top 0.254: v35.31,11.94 33.9,11.94 U3.14 | JTAG.9 41.4,15.24 41.4,12.95 41.15,12.7 39.12,12.7 v38.35,11.94
  Bottom 0.254: v38.35,11.94 v35.31,11.94
P3_3  (via drill 0.36)
  Top 0.254: U3.16 35.79,12.97 36.07,12.7 v36.07,8.89
  Bottom 0.254: JTAG.7 41.4,12.7 41.4,10.41 41.15,10.16 39.37,10.16 38.35,8.89 v36.07,8.89
P3_4  (via drill 0.36)
  Top 0.254: U3.17 33.03,13.47 32.77,13.21 32.77,10.92 v33.02,10.67 | v33.02,5.33 37.46,5.33 USER.2
  Bottom 0.254: v33.02,10.67 v33.02,5.33
P3_5
  Top 0.254: U3.18 36.32,13.97 36.58,13.72 36.58,9.91 37.08,9.4 37.08,6.6 37.34,6.35 JTAG.2
P3_6
  Top 0.254: U3.19 36.83,14.47 37.08,14.22 37.08,10.16 37.59,9.65 37.59,7.87 37.85,7.62 41.4,7.62 JTAG.1
P3_7
  Top 0.254: U3.20 37.35,14.97 37.59,14.73 37.59,11.18 37.85,10.92 39.62,10.92 JTAG.6
P4_0  (via drill 0.36)
  Top 0.254: R4.2 v10.41,9.4 | U3.22 32.48,15.97 v31.75,15.24
  Bottom 0.254: v10.41,9.4 13.46,9.4 18.29,14.22 22.1,14.22 22.35,14.48 30.23,14.48 30.73,14.99 31.5,14.99 v31.75,15.24
P7_0
  Top 0.254: U3.26 31.71,24.38 | 31.71,24.38 31.71,25.94 31.5,26.16 31.5,27.69 30.99,28.19 27.94,28.19 27.69,27.94 A.9C | R9.1 31.71,24.38
P7_1  (via drill 0.36)
  Top 0.254: U3.27 31.21,25.68 A.10C | R10.1 v32.77,21.59
  Bottom 0.254: v32.77,21.59 32.77,24.64 32.26,25.15 31.75,25.15 A.10C
P13_2  (via drill 0.36)
  Top 0.254: v10.41,13.72 9.4,13.72 R7.1 | U3.25 32.21,17.74 31.75,17.27 28.96,17.27 v28.19,16.26
  Bottom 0.254: v10.41,13.72 14.73,13.72 16.76,15.75 20.57,15.75 20.83,16 27.69,16 27.94,16.26 v28.19,16.26
USB1_DM  (via drill 0.36)  (2 unrouted)
  Top 0.254: R6.2 v10.41,12.45 | U3.24 32.21,16.97 32,16.76 29.97,16.76 v29.46,16.26
  Bottom 0.254: v10.41,12.45 14.22,12.45 17.02,15.24 21.08,15.24 21.34,15.49 28.7,15.49 v29.46,16.26
USB1_DP  (via drill 0.36)  (2 unrouted)
  Top 0.254: R5.2 v10.41,10.92 | v30.48,15.75 30.99,16.26 32,16.26 32.48,16.47 U3.23
  Bottom 0.254: v10.41,10.92 13.72,10.92 17.02,13.97 17.78,14.73 21.59,14.73 21.84,14.99 29.72,14.99 v30.48,15.75
USB1_I
  Top 0.406: USB.ID 5.73,10.02 6.6,9.4 R4.1
USB1_M
  Top 0.406: USB.D- 6.24,11.32 6.86,12.19 R6.1
USB1_P
  Top 0.406: USB.D+ 7.37,10.67 R5.1
USB1_SHIELD
  Top 0.406: USB.SHIELD2 0.7,6.67 0.51,6.86 0.51,14.22 0.76,14.48 1.84,14.48
  Top 0.61: C1.1 R3.1 2.35,6.35 USB.SHIELD2 2.6,6.1 | 1.84,14.48 USB.SHIELD1
VBAT  (via drill 0.36)
  Top 0.61: C2.1 v7.62,16.76 | BATTERY.2 J1P.1
  Top 0.813: BATTERY.2 v10.41,21.83 11.57,21.83 D1.+ 12.32,21.84 13.46,21.84 14.04,21.52 U2.3
  Bottom 0.61: v7.62,16.76 7.62,21.57 7.87,21.83 v10.41,21.83
VBUS  (via drill 0.36)
  Top 0.254: LED2.+ 4.06,28.19 3.56,27.69 3.05,27.69 2.79,27.43 2.79,25.65 3.05,25.4 4.57,25.4 4.83,25.15 4.83,24.13 5.08,23.88 6.86,23.88 v7.11,23.62
  Top 0.406: USB.VBUS 4.88,12.19
  Top 0.508: U2.4 14,19.02 13.21,19.68 10.79,19.68
  Top 0.61: 4.88,12.19 4.88,13.77 5.08,13.97 R7.2 7.62,14.48 8.13,14.99 10.67,14.99 | D2.+ 12.19,14.73 11.94,14.99 10.67,14.99 | 10.79,19.68 v10.79,16.26 10.79,15.11 10.67,14.99 | U2.4 14.04,17.71 C7.1
  Bottom 0.254: v7.11,23.62 7.11,23.37 6.86,23.11 6.86,16 7.11,15.75 10.29,15.75 v10.79,16.26
VCC  (via drill 0.36)  (4 unrouted)
  Top 0.61: v17.53,12.19 VCC.2 17.53,15.24 18.8,16.51 L2.1 L1.1 v20.32,16.76
  Top 0.813: JTAG.11 JTAG.12 39.62,19.05 38.86,19.81 v38.1,19.81 L3.1
  Bottom 0.61: v20.32,16.76 20.32,19.81
  Bottom 0.813: v38.1,19.81 20.32,19.81
VCCD
  Top 0.305: U3.37 25.06,17.1 24.89,17.27 C14.1
VDDA
  Top 0.254: U3.40 22.63,15.47 22.35,15.75 22.35,17.53 21.08,17.53 C6.1
  Top 0.61: C6.1 C8.1 L2.2
VDDD
  Top 0.254: U3.39 24.16,15.97 23.88,16.26 23.88,16.76 | 23.88,16.76 23.88,17.78 C11.1 | L1.2 23.88,16.76
  Top 0.305: C11.1 C10.1
VDDIO
  Top 0.254: R9.2 R10.2 R11.2 36.32,21.08 36.07,20.83 36.07,18.29 | U3.21 35.79,15.47 36.07,15.75 36.07,18.03 36.32,18.29
  Top 0.813: L3.2 36.32,18.29 36.07,18.29 C17.1 C16.1
VIN
  Top 0.813: F1.1 12.19,16.13 D2.- D1.-

### Text on the board
tPlace: P0_7 | P0_6 | P0_5 | P0_4 | P0_3 | P0_2 | P0_0 | P0_1 | P7_0 | P7_1 | 5V0 | GND | Li-Po | P1_5 | P1_6 | P2_4 | P2_5 | P2_6 | P2_7 | P2_3 | P2_2 | P2_1 | P2_0 | 3V3 | GND | P1_4
bPlace: P0_3 | P0_2 | P0_1 | P0_0 | P3_7 | P3_6 | P3_5 | P3_4 | P3_0 | P3_1 | 5V0 | GND | !RI | !DSR | !DTR | !RTS | !CTS | RXD | TXD | SCL | SDA | 5V0 | GND | PatternAgents | TSOC_CY8C4247AZI_L433 | Rev. 1.0 | Serial Number: | IO2 | IO1 | SS2 | SS1 | !IRQ | !ATN | !SSEL | SCK | MISO | MOSI | P0_4 | P0_5 | P0_6 | P0_7 | P1_0 | P1_1 | P1_2 | P1_3 | P1_4 | P1_5 | 3V3 | GND